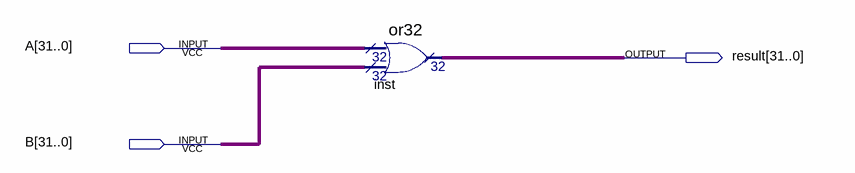
[diagram p0: schematic sheet]
// Quartus schematic OR32.bdf as structural Verilog: 1 symbols, 3 pins
module OR32 (
  input  [31:0] A,
  input  [31:0] B,
  output [31:0] result
);

  or32 inst (.data0x(A), .data1x(B), .result(result));
endmodule
